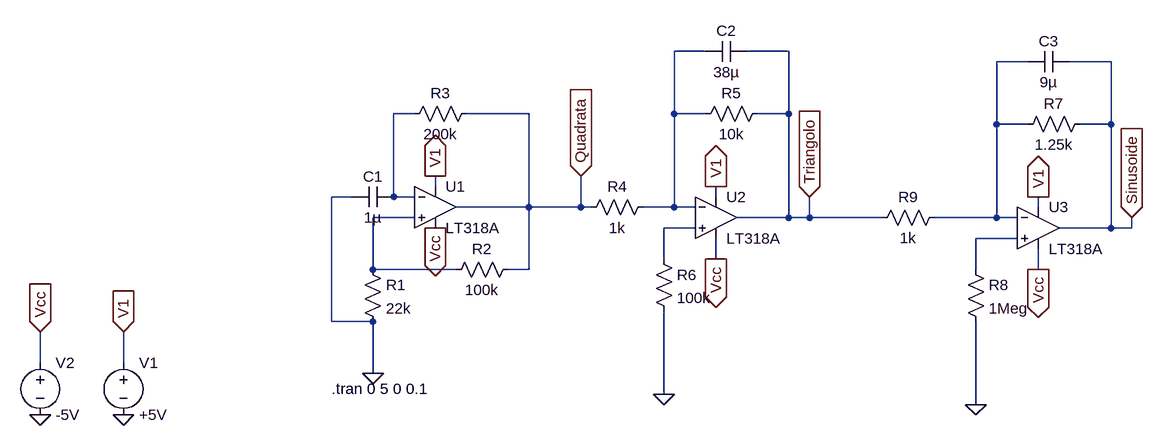
[diagram p0: schematic progetto_PSE.asc]
progetto_PSE.asc, the LTspice schematic file:
Version 4
SHEET 1 1848 868
WIRE 640 -80 592 -80
WIRE 768 -80 704 -80
WIRE 1136 -64 1088 -64
WIRE 1264 -64 1200 -64
WIRE 192 16 160 16
WIRE 368 16 272 16
WIRE 592 16 592 -80
WIRE 640 16 592 16
WIRE 768 16 768 -80
WIRE 768 16 720 16
WIRE 1088 32 1088 -64
WIRE 1136 32 1088 32
WIRE 1264 32 1264 -64
WIRE 1264 32 1216 32
WIRE 224 128 224 112
WIRE 96 144 64 144
WIRE 160 144 160 16
WIRE 192 144 160 144
WIRE 656 144 656 128
WIRE 368 160 368 16
WIRE 368 160 256 160
WIRE 448 160 448 112
WIRE 448 160 368 160
WIRE 464 160 448 160
WIRE 592 160 592 16
WIRE 592 160 544 160
WIRE 624 160 592 160
WIRE 1152 160 1152 144
WIRE 192 176 128 176
WIRE 768 176 768 16
WIRE 768 176 688 176
WIRE 800 176 800 144
WIRE 800 176 768 176
WIRE 912 176 800 176
WIRE 1088 176 1088 32
WIRE 1088 176 992 176
WIRE 1120 176 1088 176
WIRE 624 192 576 192
WIRE 1264 192 1264 32
WIRE 1264 192 1184 192
WIRE 1296 192 1296 176
WIRE 1296 192 1264 192
WIRE 1120 208 1056 208
WIRE 576 240 576 192
WIRE 656 240 656 208
WIRE 128 256 128 176
WIRE 256 256 128 256
WIRE 368 256 368 160
WIRE 368 256 336 256
WIRE 1056 256 1056 208
WIRE 1152 256 1152 224
WIRE 64 336 64 144
WIRE 128 336 64 336
WIRE -384 400 -384 352
WIRE -256 400 -256 352
WIRE 128 416 128 336
WIRE 576 448 576 320
WIRE 1056 464 1056 336
FLAG 128 416 0
FLAG -256 480 0
FLAG 576 448 0
FLAG -256 352 V1
IOPIN -256 352 In
FLAG 656 128 V1
IOPIN 656 128 Out
FLAG 224 112 V1
IOPIN 224 112 Out
FLAG -384 480 0
FLAG -384 352 Vcc
IOPIN -384 352 In
FLAG 224 192 Vcc
IOPIN 224 192 Out
FLAG 656 240 Vcc
IOPIN 656 240 Out
FLAG 800 144 Triangolo
IOPIN 800 144 In
FLAG 448 112 Quadrata
IOPIN 448 112 In
FLAG 1056 464 0
FLAG 1152 144 V1
IOPIN 1152 144 Out
FLAG 1152 256 Vcc
IOPIN 1152 256 Out
FLAG 1296 176 Sinusoide
IOPIN 1296 176 In
SYMBOL Opamps\\LT318A 224 160 R0
SYMATTR InstName U1
SYMBOL cap 160 128 R90
WINDOW 0 0 32 VBottom 2
WINDOW 3 32 32 VTop 2
SYMATTR InstName C1
SYMATTR Value 1µ
SYMBOL res 112 240 R0
SYMATTR InstName R1
SYMATTR Value 22k
SYMBOL res 352 240 R90
WINDOW 0 0 56 VBottom 2
WINDOW 3 32 56 VTop 2
SYMATTR InstName R2
SYMATTR Value 100k
SYMBOL res 288 0 R90
WINDOW 0 0 56 VBottom 2
WINDOW 3 32 56 VTop 2
SYMATTR InstName R3
SYMATTR Value 200k
SYMBOL voltage -256 384 R0
WINDOW 123 0 0 Left 0
WINDOW 39 0 0 Left 0
SYMATTR InstName V1
SYMATTR Value +5V
SYMBOL voltage -384 384 R0
WINDOW 123 0 0 Left 0
WINDOW 39 0 0 Left 0
SYMATTR InstName V2
SYMATTR Value -5V
SYMBOL res 560 144 R90
WINDOW 0 0 56 VBottom 2
WINDOW 3 32 56 VTop 2
SYMATTR InstName R4
SYMATTR Value 1k
SYMBOL Opamps\\LT318A 656 176 R0
SYMATTR InstName U2
SYMBOL res 736 0 R90
WINDOW 0 0 56 VBottom 2
WINDOW 3 32 56 VTop 2
SYMATTR InstName R5
SYMATTR Value 10k
SYMBOL cap 704 -96 R90
WINDOW 0 0 32 VBottom 2
WINDOW 3 32 32 VTop 2
SYMATTR InstName C2
SYMATTR Value 38µ
SYMBOL res 560 224 R0
SYMATTR InstName R6
SYMATTR Value 100k
SYMBOL Opamps\\LT318A 1152 192 R0
SYMATTR InstName U3
SYMBOL res 1232 16 R90
WINDOW 0 0 56 VBottom 2
WINDOW 3 32 56 VTop 2
SYMATTR InstName R7
SYMATTR Value 1.25k
SYMBOL cap 1200 -80 R90
WINDOW 0 0 32 VBottom 2
WINDOW 3 32 32 VTop 2
SYMATTR InstName C3
SYMATTR Value 9µ
SYMBOL res 1040 240 R0
SYMATTR InstName R8
SYMATTR Value 1Meg
SYMBOL res 1008 160 R90
WINDOW 0 0 56 VBottom 2
WINDOW 3 32 56 VTop 2
SYMATTR InstName R9
SYMATTR Value 1k
TEXT 64 440 Left 2 !.tran 0 5 0 0.1

The netlist it stands for:
* progetto_PSE.asc
* U1: LT318A (symbol Opamps\LT318A not available, pins judged from their places): In+=N004 In-=N003 V+=V1 V-=Vcc OUT=Quadrata
C1 N003 0 1µ
R1 N004 0 22k
R2 Quadrata N004 100k
R3 Quadrata N003 200k
V1 V1 0 +5V
V2 Vcc 0 -5V
R4 N001 Quadrata 1k
* U2: LT318A (symbol Opamps\LT318A not available, pins judged from their places): In+=N005 In-=N001 V+=V1 V-=Vcc OUT=Triangolo
R5 Triangolo N001 10k
C2 Triangolo N001 38µ
R6 N005 0 100k
* U3: LT318A (symbol Opamps\LT318A not available, pins judged from their places): In+=N006 In-=N002 V+=V1 V-=Vcc OUT=Sinusoide
R7 Sinusoide N002 1.25k
C3 Sinusoide N002 9µ
R8 N006 0 1Meg
R9 N002 Triangolo 1k
.tran 0 5 0 0.1
.backanno
.end